# EAGLE design v11 (EAGLE 9.3.0)
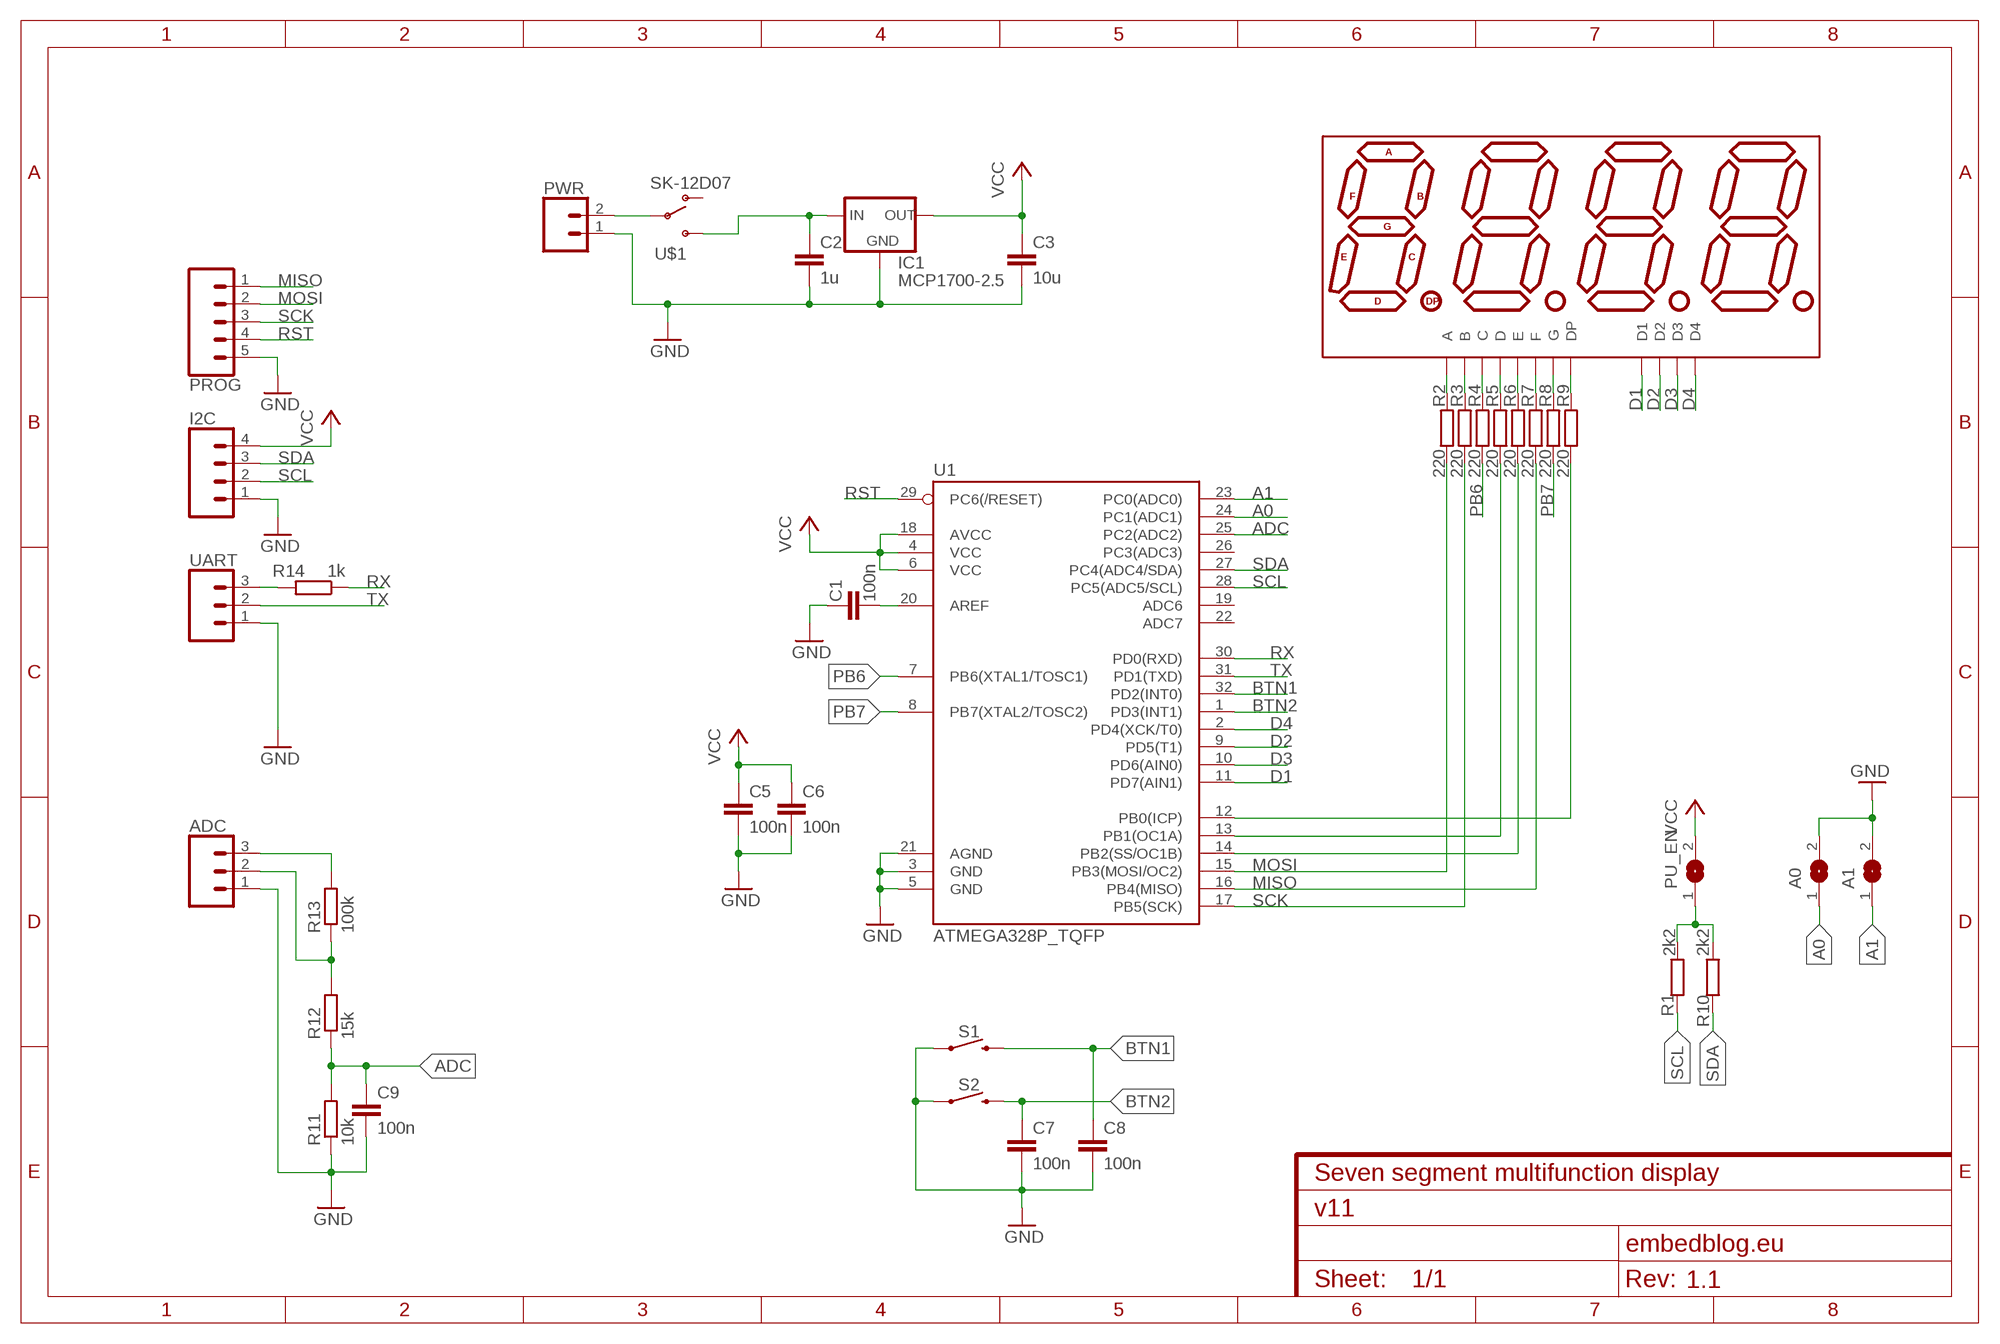
[diagram p0: schematic, sheet 1]
FRAME1 (FRAME-A4L): CNAME: Seven segment multifunction display; CREVISION: 1.1; DESIGNER: embedblog.eu; REV: 1.1

## Parts
A0  SJ  [SJ]
A1  SJ  [SJ]
ADC  455-1750-1-ND  CONN_03  [1X03]
C1  100n  C-EUC1206  [C1206]
C2  1u  C-EUC1206  [C1206]
C3  10u  C-EUC1206  [C1206]
C5  100n  C-EUC1206  [C1206]
C6  100n  C-EUC1206  [C1206]
C7  100n  C-EUC1206  [C1206]
C8  100n  C-EUC1206  [C1206]
C9  100n  C-EUC1206  [C1206]
D1  7-SEG_0.56INCH  [7SEG_0.56INCH]
I2C  CONN_04  [1X04]
IC1  MCP1700-2.5  XC63FPM  [SOT23]
PROG  CONN_05  [1X05]
PU_EN  SJ  [SJ]
PWR  CONN_02  [1X02]
R1  2k2  R-EU_R1206  [R1206]
R2  220  R-EU_R1206  [R1206]
R3  220  R-EU_R1206  [R1206]
R4  220  R-EU_R1206  [R1206]
R5  220  R-EU_R1206  [R1206]
R6  220  R-EU_R1206  [R1206]
R7  220  R-EU_R1206  [R1206]
R8  220  R-EU_R1206  [R1206]
R9  220  R-EU_R1206  [R1206]
R10  2k2  R-EU_R1206  [R1206]
R11  10k  R-EU_R1206  [R1206]
R12  15k  R-EU_R1206  [R1206]
R13  100k  R-EU_R1206  [R1206]
R14  1k  R-EU_R1206  [R1206]
S1  MOMENTARY-SWITCH-SPST-PTH-6.0MM  [TACTILE_SWITCH_PTH_6.0MM]
S2  MOMENTARY-SWITCH-SPST-PTH-6.0MM  [TACTILE_SWITCH_PTH_6.0MM]
U1  ATMEGA328P_TQFP  [TQFP32-08]
U$1  SK-12D07  [SK12SWITCH]
UART  455-1750-1-ND  CONN_03  [1X03]

## Nets
+3V3: C3.1 C5.1 C6.1 I2C.4 IC1.2(OUT) PU_EN.2 U1.4(VCC) U1.6(VCC) U1.18(AVCC) ; supply symbol labelled VCC
A0: A0.1 U1.24(PC1(ADC1))
A1: A1.1 U1.23(PC0(ADC0))
ADC: C9.1 R11.2 R12.1 U1.25(PC2(ADC2))
BTN1: C8.1 S1.3 U1.32(PD2(INT0))
BTN2: C7.1 S2.3 U1.1(PD3(INT1))
D1: D1.D1 U1.11(PD7(AIN1))
D2: D1.D2 U1.9(PD5(T1))
D3: D1.D3 U1.10(PD6(AIN0))
D4: D1.D4 U1.2(PD4(XCK/T0))
GND: A0.2 A1.2 ADC.1 C1.1 C2.2 C3.2 C5.2 C6.2 C7.2 C8.2 C9.2 I2C.1 IC1.1(GND) PROG.5 PWR.1 R11.1 S1.1 S2.1 U1.3(GND) U1.5(GND) U1.21(AGND) UART.1
MISO: PROG.1 R7.1 U1.16(PB4(MISO))
MOSI: PROG.2 R2.1 U1.15(PB3(MOSI/OC2))
N$1: PWR.2 U$1.P2(P)
N$2: C2.1 IC1.3(IN) U$1.IN(S)
N$3: PU_EN.1 R1.2 R10.2
N$5: R14.2 UART.3
N$6: ADC.3 R13.2
N$7: ADC.2 R12.2 R13.1
N$8: D1.A R2.2
N$9: D1.B R3.2
N$10: D1.C R4.2
N$11: D1.D R5.2
N$12: D1.E R6.2
N$13: D1.F R7.2
N$14: D1.G R8.2
N$15: D1.DP R9.2
N$17: C1.2 U1.20(AREF)
N$19: R6.1 U1.14(PB2(SS/OC1B))
N$20: R5.1 U1.13(PB1(OC1A))
N$22: R9.1 U1.12(PB0(ICP))
PB6: R4.1 U1.7(PB6(XTAL1/TOSC1))
PB7: R8.1 U1.8(PB7(XTAL2/TOSC2))
RST: PROG.4 U1.29(PC6(/RESET))
RX: R14.1 U1.30(PD0(RXD))
SCK: PROG.3 R3.1 U1.17(PB5(SCK))
SCL: I2C.2 R1.1 U1.28(PC5(ADC5/SCL))
SDA: I2C.3 R10.1 U1.27(PC4(ADC4/SDA))
TX: U1.31(PD1(TXD)) UART.2
Unconnected: U1.19(ADC6) U1.22(ADC7) U1.26(PC3(ADC3)) U$1.P1(O)

## Library data of the parts
A0 A1 PU_EN = jumper:SJ: SMD solder JUMPER
ADC UART = SparkFun-Connectors:CONN_03: Multi connection point. Often used as Generic Header-pin footprint for 0.1 inch spaced/style header connections On any of the 0.1 inch spaced packages, you can populate with these: Break Away Headers - Straight <https://www.sparkfun.com/products/116> (PRT-00116) Break Away Male Headers - Right Angle <https://www.sparkfun.com/products/553> (PRT-00553) Female Headers <https://www.sparkfun.com/products/115> (PRT-00115) Break Away Headers - Machine Pin <https://www.sparkfun.com/products/117> (PRT-00117) Break Away Female Headers - Swiss Machine Pin <https://www.sparkfun.com/products/743> (PRT-00743) Stackable Header - 3 Pin (Female, 0.1") <https://www.sparkfun.com/products/13875> (PRT-13875) For SCREWTERMINALS and SPRING TERMINALS visit here: Screw Terimnals on SparkFun.com <https://www.sparkfun.com/search/results?term=Screw+Terminals> (5mm/3.5mm/2.54mm spacing) This device is also useful as a general connection point to wire up your design to another part of your project. Our various solder wires solder well into these plated through hole pads. Hook-Up Wire - Assortment (Stranded, 22 AWG) <https://www.sparkfun.com/products/11375> (PRT-11375) Hook-Up Wire - Assortment (Solid Core, 22 AWG) <https://www.sparkfun.com/products/11367> (PRT-11367) View the entire wire category on our website here <https://www.sparkfun.com/categories/141> Special notes: Molex polarized connector foot print use with SKU : PRT-08232 with associated crimp pins and housings.; PROD_ID: XXX-00000
C1-C3 C5-C9 = resistor:C-EU: CAPACITOR, European symbol
D1 = custom:7-SEG_0.56INCH
I2C = SparkFun-Connectors:CONN_04: Multi connection point. Often used as Generic Header-pin footprint for 0.1 inch spaced/style header connections On any of the 0.1 inch spaced packages, you can populate with these: Break Away Headers - Straight <https://www.sparkfun.com/products/116> (PRT-00116) Break Away Male Headers - Right Angle <https://www.sparkfun.com/products/553> (PRT-00553) Female Headers <https://www.sparkfun.com/products/115> (PRT-00115) Break Away Headers - Machine Pin <https://www.sparkfun.com/products/117> (PRT-00117) Break Away Female Headers - Swiss Machine Pin <https://www.sparkfun.com/products/743> (PRT-00743) For SCREWTERMINALS and SPRING TERMINALS visit here: Screw Terimnals on SparkFun.com <https://www.sparkfun.com/search/results?term=Screw+Terminals> (5mm/3.5mm/2.54mm spacing) This device is also useful as a general connection point to wire up your design to another part of your project. Our various solder wires solder well into these plated through hole pads. Hook-Up Wire - Assortment (Stranded, 22 AWG) <https://www.sparkfun.com/products/11375> (PRT-11375) Hook-Up Wire - Assortment (Solid Core, 22 AWG) <https://www.sparkfun.com/products/11367> (PRT-11367) View the entire wire category on our website here <https://www.sparkfun.com/categories/141> Special notes: Molex polarized connector foot print use with SKU : PRT-08231 with associated crimp pins and housings. 1MM SMD Version SKU: PRT-10208; PROD_ID: CONN-09696
IC1 = v-reg:XC63FP: Positiv Voltage Regulators www.torex.co.jp/english/product/pro02/pdf/0201_xc62fp.pdf
PROG = SparkFun-Connectors:CONN_05: Multi connection point. Often used as Generic Header-pin footprint for 0.1 inch spaced/style header connections On any of the 0.1 inch spaced packages, you can populate with these: Break Away Headers - Straight <https://www.sparkfun.com/products/116> (PRT-00116) Break Away Male Headers - Right Angle <https://www.sparkfun.com/products/553> (PRT-00553) Female Headers <https://www.sparkfun.com/products/115> (PRT-00115) Break Away Headers - Machine Pin <https://www.sparkfun.com/products/117> (PRT-00117) Break Away Female Headers - Swiss Machine Pin <https://www.sparkfun.com/products/743> (PRT-00743) For SCREWTERMINALS and SPRING TERMINALS visit here: Screw Terimnals on SparkFun.com <https://www.sparkfun.com/search/results?term=Screw+Terminals> (5mm/3.5mm/2.54mm spacing) This device is also useful as a general connection point to wire up your design to another part of your project. Our various solder wires solder well into these plated through hole pads. Hook-Up Wire - Assortment (Stranded, 22 AWG) <https://www.sparkfun.com/products/11375> (PRT-11375) Hook-Up Wire - Assortment (Solid Core, 22 AWG) <https://www.sparkfun.com/products/11367> (PRT-11367) View the entire wire category on our website here <https://www.sparkfun.com/categories/141> Special notes: Molex polarized connector foot print use with SKU : PRT-08231 with associated crimp pins and housings. 1MM SMD Version SKU: PRT-10208
PWR = SparkFun-Connectors:CONN_02: Multi connection point. Often used as Generic Header-pin footprint for 0.1 inch spaced/style header connections On any of the 0.1 inch spaced packages, you can populate with these: Break Away Headers - Straight <https://www.sparkfun.com/products/116> (PRT-00116) Break Away Male Headers - Right Angle <https://www.sparkfun.com/products/553> (PRT-00553) Female Headers <https://www.sparkfun.com/products/115> (PRT-00115) Break Away Headers - Machine Pin <https://www.sparkfun.com/products/117> (PRT-00117) Break Away Female Headers - Swiss Machine Pin <https://www.sparkfun.com/products/743> (PRT-00743) For SCREWTERMINALS and SPRING TERMINALS visit here: Screw Terimnals on SparkFun.com <https://www.sparkfun.com/search/results?term=Screw+Terminals> (5mm/3.5mm/2.54mm spacing) This device is also useful as a general connection point to wire up your design to another part of your project. Our various solder wires solder well into these plated through hole pads. Hook-Up Wire - Assortment (Stranded, 22 AWG) <https://www.sparkfun.com/products/11375> (PRT-11375) Hook-Up Wire - Assortment (Solid Core, 22 AWG) <https://www.sparkfun.com/products/11367> (PRT-11367) View the entire wire category on our website here <https://www.sparkfun.com/categories/141> Special notes: Molex polarized connector foot print use with: PRT-08233 with associated crimp pins and housings. 2.54_SCREWTERM for use with PRT-10571. 3.5mm Screw Terminal footprints for PRT-08084 5mm Screw Terminal footprints for use with PRT-08432
R1-R14 = resistor:R-EU_: RESISTOR, European symbol
S1 S2 = SparkFun-Switches:MOMENTARY-SWITCH-SPST: Momentary Switch (Pushbutton) - SPST Normally-open (NO) SPST momentary switches (buttons, pushbuttons). Variants PTH-12MM - 12mm square, through-hole Momentary Pushbutton Switch - 12mm Square <https://www.sparkfun.com/products/9190> (COM-09190) PTH-6.0MM, PTH-6.0MM-KIT - 6.0mm square, through-hole Mini Pushbutton Switch <https://www.sparkfun.com/products/97> (COM-00097) KIT package intended for soldering kit's - only one side of pads' copper is exposed. PTH-RIGHT-ANGLE-KIT - Right-angle, through-hole Right Angle Tactile Button <https://www.sparkfun.com/products/10791> - Used on SparkFun BigTime Watch Kit <https://www.sparkfun.com/products/11734> SMD-12MM - 12mm square, surface-mount Tactile Button - SMD (12mm) <https://www.sparkfun.com/products/12993> (COM-12993) Used on SparkFun PicoBoard <https://www.sparkfun.com/products/11888> SMD-4.5MM - 4.5mm Square Trackball Switch Used on SparkFun Blackberry Trackballer Breakout <https://www.sparkfun.com/products/13169> SMD-4.6MMX2.8MM - 4.60mm x 2.80mm, surface mount Used on SparkFun SAMD21 Mini Breakout <https://www.sparkfun.com/products/13664> SMD-5.2MM, SMD-5.2-REDUNDANT - 5.2mm square, surface-mount Mini Pushbutton Switch - SMD <https://www.sparkfun.com/products/8720> (COM-08720) Used on Arduino Pro Mini <https://www.sparkfun.com/products/11114> REDUNDANT package connects both switch circuits together SMD-6.0X3.5MM - 6.0 x 3.5mm, surface mount Momentary Reset Switch SMD <https://www.sparkfun.com/products/8229> (COM-08229) SMD-6.2MM-TALL - 6.2mm square, surface mount Tactile Button - SMD (6mm) <https://www.sparkfun.com/products/12992> Used on SparkFun Digital Sandbox <https://www.sparkfun.com/products/12651> SMD-RIGHT-ANGLE - Right-angle, surface mount Used on SparkFun Block for Intel® Edison - Arduino <https://www.sparkfun.com/products/13036>; PROD_ID: SWCH-08441; SF_SKU: COM-00097
U1 = SparkFun-DigitalIC:ATMEGA328P_TQFP; PROD_ID: IC-09069
U$1 = custom:SK-12D07

## Board
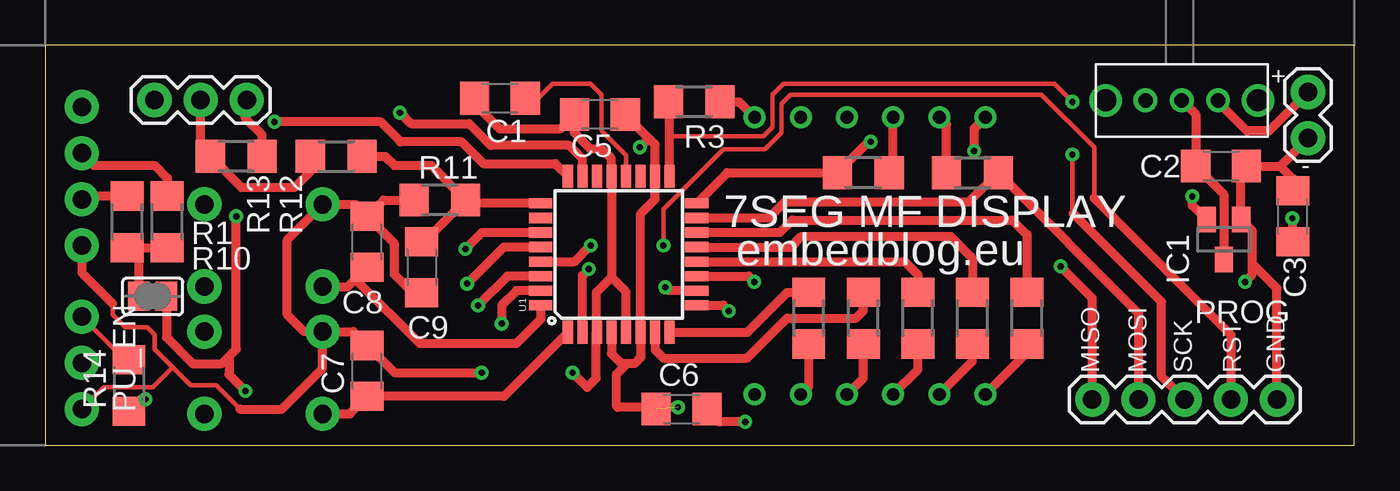
[diagram p1: board, top side]
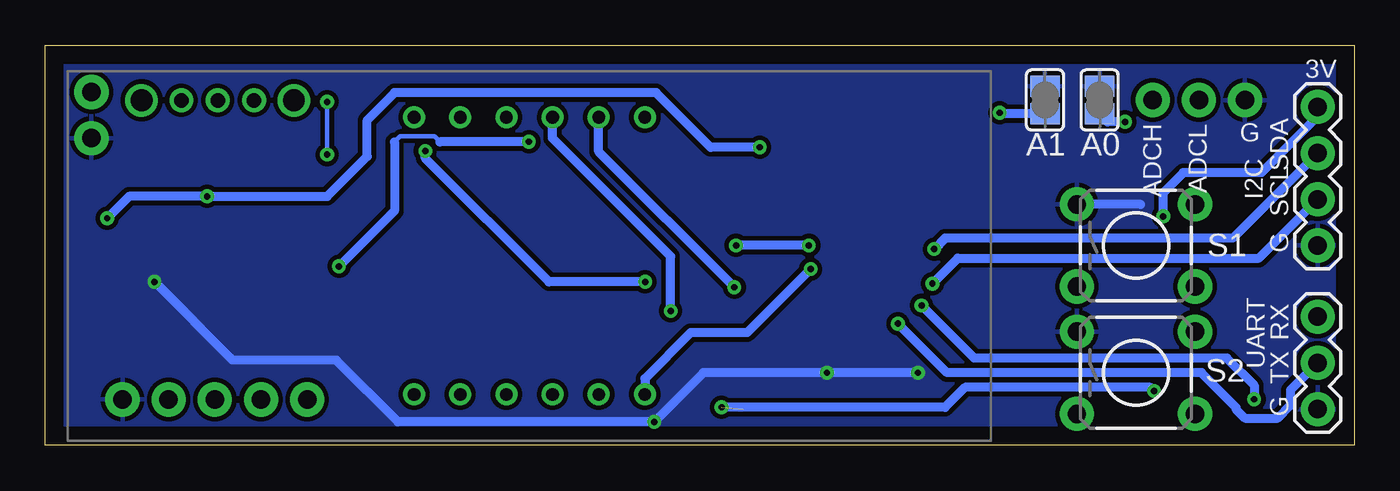
[diagram p2: board, bottom side, seen from below]

Size 72 x 22 mm. Coordinates in mm from the lower left corner, seen from the top.
Outline: 0,0 72,0 72,22 0,22 0,0
Copper layers (1*16): Top 0.035mm / dielectric 1.5mm / Bottom 0.035mm
Design rules "default": minimum track width 6mil, minimum drill 0.35mm, track to track 6mil, track to pad 6mil, pad to pad 6mil, via to via 6mil, smd to smd 6mil, copper to edge 40mil, drill to drill 6mil, minimum pad ring 10mil, minimum via ring 8mil, stop-mask expansion 4mil, vias tented up to drill 0mil, thermal gap 10mil

### Footprints (pad centres in the part's own frame; a part is rotated, then mirrored left to right if it is on the bottom)
SJ = smd 1.168 x 1.6: 1 -0.762,0; 2 0.762,0
1X03 = drill 1.016 pad 1.88: 1 0,0; 2 2.54,0; 3 5.08,0
C1206 = smd 1.6 x 1.8: 1 -1.4,0; 2 1.4,0
7SEG_0.56INCH = drill 0.7: A 2.54,15.24; B 12.7,15.24; C 7.62,0; D 2.54,0; D1 0,15.24; D2 7.62,15.24; D3 10.16,15.24; D4 12.7,0; DP 5.08,0; E 0,0; F 5.08,15.24; G 10.16,0
1X04 = drill 1.016 pad 1.88: 1 0,0; 2 2.54,0; 3 5.08,0; 4 7.62,0
SOT23 = smd 1 x 1.4: 1 -0.95,-1.1; 2 0.95,-1.1; 3 0,1.1
1X05 = drill 1.016 pad 1.88: 1 0,0; 2 2.54,0; 3 5.08,0; 4 7.62,0; 5 10.16,0
1X02 = drill 1.016 pad 1.88: 1 0,0; 2 2.54,0
R1206 = smd 1.6 x 1.803: 1 -1.422,0; 2 1.422,0
TACTILE_SWITCH_PTH_6.0MM = drill 1.016 pad 1.88: 1 -3.251,2.261; 2 3.251,2.261; 3 -3.251,-2.261; 4 3.251,-2.261
TQFP32-08 = smd 1.27 x 0.559: 1 -4.293,2.8; 2 -4.293,2; 3 -4.293,1.2; 4 -4.293,0.4; 5 -4.293,-0.4; 6 -4.293,-1.2; 7 -4.293,-2; 8 -4.293,-2.8; 17 4.293,-2.8; 18 4.293,-2; 19 4.293,-1.2; 20 4.293,-0.4; 21 4.293,0.4; 22 4.293,1.2; 23 4.293,2; 24 4.293,2.8 | smd 0.559 x 1.27: 9 -2.8,-4.293; 10 -2,-4.293; 11 -1.2,-4.293; 12 -0.4,-4.293; 13 0.4,-4.293; 14 1.2,-4.293; 15 2,-4.293; 16 2.8,-4.293; 25 2.8,4.293; 26 2,4.293; 27 1.2,4.293; 28 0.4,4.293; 29 -0.4,4.293; 30 -1.2,4.293; 31 -2,4.293; 32 -2.8,4.293
SK12SWITCH = drill 0.8: IN 0,0; P1 0,2; P2 0,-2 | drill 1.2: PIN1 0,4.191; PIN2 0,-4.191

### Placement (x,y rotation side)
A0  14,19 90 bottom
A1  17,19 90 bottom
ADC  6,19 0 top
C1  25,19.1 0 top
C2  64.68,15.37 0 top
C3  68.63,12.6 90 top
C5  30.5,18.2 180 top
C6  35,2 0 top
C7  17.7,4.1 90 top
C8  17.7,11.2 90 top
C9  20.7,9.8 270 top
D1  51.72,2.81 0 bottom
I2C  2,11 90 bottom
IC1  64.83,11.33 180 top
PROG  57.6,2.53 0 top
PU_EN  5.9,8.2 0 top
PWR  69.47,16.9 90 top
R1  4.5,12.3 270 top
R2  51,15 180 top
R3  35.7,18.9 0 top
R4  45,7 270 top
R5  51,7 270 top
R6  54,7 270 top
R7  45,15 0 top
R8  42,7 270 top
R9  48,7 270 top
R10  6.7,12.3 270 top
R11  21.7,13.5 0 top
R12  16,15.9 180 top
R13  10.5,15.9 0 top
R14  4.6,3.3 90 top
S1  12,11 0 bottom
S2  12,4 0 bottom
U1  31.54,10.51 90 top
U$1  62.52,18.98 90 top
UART  2,2 90 bottom

### Tracks (layer width: path | path; a pad name or v marks a point on that pad's centre or on a via)
+3V3  (via drill 0.35)  (1 unrouted)
  Top 0.508: IC1.2 63.1,13.21 v63.1,13.7 | v68.6,12.5 68.6,11.23 C3.1 | U1.4 31.14,5.06 31.7,4.5 32,4.5 | 32,4.5 32.4,4.5 32.74,4.84 U1.6 32.74,12.74 33.54,13.54 U1.18 33.54,16.56 33.3,16.8 | 32,4.5 31.4,3.9 31.4,2.2 31.5,2.1 v34.8,2.1 | 33.3,16.8 C5.1 | v32.7,16.4 33.1,16.8 33.3,16.8 | PU_EN.2 6.66,5.94 8.1,4.5 9.7,4.5 10.1,4.9 | 10.1,4.9 10.5,5.3 v10.5,12.6 | 10.1,4.9 10.1,3.9 v11,3
  Bottom 0.508: v68.6,12.5 67.4,13.7 v63.1,13.7 56.5,13.7 54.3,15.9 54.3,17.9 52.8,19.4 38.4,19.4 35.4,16.4 v32.7,16.4 | v10.5,12.6 10.5,13.9 9.4,15 5.1,15 2,18.1 I2C.4 | v11,3 11.2,3.2 21.4,3.2 22.5,2.1 v34.8,2.1
A0  (via drill 0.35)
  Top 0.508: U1.24 28.05,15.5 24.1,15.5 22.9,16.7 19.54,16.7 18.44,17.8 v12.6,17.8
  Bottom 0.508: v12.6,17.8 13.56,17.8 A0.1
A1  (via drill 0.35)
  Top 0.508: U1.23 29.54,15.76 28.8,16.5 24.5,16.5 23.3,17.7 20.1,17.7 v19.5,18.3
  Bottom 0.508: A1.1 19.44,18.24 v19.5,18.3
ADC
  Top 0.508: C9.1 20.82,11.2 R11.2 | R12.1 18.7,15.9 19.2,15.4 21.22,15.4 R11.2 | U1.25 23.31,13.31 R11.2
BTN1
  Top 0.508: U1.32 27.25,6.95 25.9,5.6 20.6,5.6 17.05,9.15 | S1.3 16.64,8.74 17.05,9.15 | 17.05,9.15 C8.1
BTN2
  Top 0.508: S2.3 16.74,1.74 C7.1 25.22,2.7 U1.1
D1  (via drill 0.35)
  Top 0.508: U1.11 38.69,9.31 v39,9 | v51.1,16.2 51.1,17.43 D1.D1
  Bottom 0.508: v39,9 44.3,9 51.1,15.8 v51.1,16.2
D2  (via drill 0.35)
  Top 0.508: U1.9 37.29,7.71 v37.6,7.4
  Bottom 0.508: v37.6,7.4 37.6,10.4 44.1,16.9 D1.D2
D3  (via drill 0.35)
  Top 0.508: U1.10 34.29,8.51 v34.1,8.7
  Bottom 0.508: v34.1,8.7 41.56,16.16 D1.D3
D4  (via drill 0.35)
  Top 0.508: U1.2 29.54,9.34 v29.9,9.7
  Bottom 0.508: v29.9,9.7 33.4,6.2 36.5,6.2 39.02,3.68 D1.D4
GND  (via drill 0.35)
  Top 0.254: 3.7,7.8 3.7,7.2 4.4,6.5 5.6,6.5 6,6.1 6,5.3 7,4.3 | 7,4.3 8,3.3 9.4,3.3 10.7,2 | UART.1 3.2,3.2 5.9,3.2 7,4.3
  Top 0.508: 31.14,9.24 U1.21 31.14,15.76 30.6,16.3 30,16.3 29.1,17.2 C5.2 28.3,17.4 25,17.4 23.6,18.8 C1.1 | 31.14,9.24 30.3,8.4 30.3,6.26 | 30.3,6.26 U1.3 | U1.5 31.94,8.44 31.14,9.24 | C2.2 66.2,15.37 | 66.2,15.37 67.94,15.37 | 67.94,15.37 PWR.1 | C3.2 68.63,14.68 67.94,15.37 | 66.2,15.37 65.78,14.95 IC1.1 66.4,11.81 66.4,10 | PROG.5 67.76,8.64 66.4,10 | 30.3,6.26 30.3,3.7 29.8,3.2 v29,4 | v38.5,1.3 37.1,1.3 C6.2 | v66,9 66.4,9.4 66.4,10 | C8.2 17.04,13.26 S1.1 13.3,11.31 13.3,7.2 14.24,6.26 S2.1 | S2.1 16.94,6.26 C7.2 19.2,4 v24,4 | 3.7,7.8 2,9.5 I2C.1 | C8.2 18.6,13.5 R11.1 | C9.2 20.2,8.4 19.2,9.4 19.2,11.1 C8.2 | S2.1 15.25,4.25 13,2 10.7,2
  Bottom 0.508: v66,9 61.7,4.7 56,4.7 52.6,1.3 v38.5,1.3 35.8,4 v29,4 v24,4 | 11.74,13.26 S1.1
  pour Bottom (isolate 0.254): 0,0 72,0 72,22 0,22
MISO  (via drill 0.35)
  Top 0.508: U1.16 37.52,15 R7.1 45.28,16.7 v45.4,16.7 | PROG.1 57.6,8.1 v55.85,9.85
  Bottom 0.254: 50.3,16.7 50.6,17 52.5,17 52.8,16.7
  Bottom 0.508: v45.4,16.7 50.3,16.7 | 52.8,16.7 52.8,12.9 v55.85,9.85
MOSI
  Top 0.508: U1.15 39.81,12.51 40.7,13.4 50.82,13.4 R2.1 60.14,7.28 PROG.2
N$1
  Top 0.508: PWR.2 67.33,17.3 66.1,17.3 64.52,18.88 U$1.P2
N$2
  Top 0.508: U$1.IN 63.28,18.22 C2.1 64.83,13.82 IC1.3
N$3
  Top 0.508: R10.2 R1.2 5.14,10.24 PU_EN.1
N$5
  Top 0.254: R14.2 4.36,4.72 UART.3
N$6
  Top 0.508: 12,15.98 R13.2 11.92,17.08 11,18 11,18.92 ADC.3
N$7
  Top 0.508: ADC.2 8.54,16.44 R13.1 10.78,14.2 13.7,14.2 14.58,15.08 R12.2
N$8
  Top 0.508: R2.2 49.58,17.65 D1.A
N$9
  Top 0.508: R3.2 38.17,18.9 D1.B
N$10
  Top 0.508: D1.C 45,3.71 R4.2
N$11
  Top 0.508: D1.D 51,4.63 R5.2
N$12
  Top 0.508: D1.E 54,5.09 R6.2
N$13
  Top 0.508: R7.2 46.64,15.22 D1.F
N$14
  Top 0.508: D1.G 42,3.25 R8.2
N$15
  Top 0.508: D1.DP 48,4.17 R9.2
N$17
  Top 0.254: C1.2 27.1,19.1 27.9,19.9 30,19.9 30.6,19.3 30.6,17.3 31.94,15.96 U1.20
N$19
  Top 0.508: U1.14 40.41,11.71 41.1,12.4 53.2,12.4 54,11.6 R6.1
N$20
  Top 0.508: U1.13 41.01,10.91 41.6,11.5 49.8,11.5 51,10.3 R5.1
N$22
  Top 0.508: U1.12 47.29,10.11 48,9.4 R9.1
PB6
  Top 0.508: U1.7 33.54,5.26 34,4.8 38.6,4.8 40.8,7 44.6,7 45,7.4 R4.1
PB7
  Top 0.508: U1.8 38.62,6.22 40.82,8.42 R8.1
RST  (via drill 0.35)
  Top 0.254: v34,11 34,13 37.3,16.3 39.6,16.3 40.5,17.2 40.5,18.8 41,19.3 54.8,19.3 57.7,16.4 57.7,13.6
  Top 0.508: U1.29 29.11,10.11 v30,11 | 57.7,13.6 65.22,6.08 PROG.4
  Bottom 0.508: v30,11 v34,11
RX  (via drill 0.35)
  Top 0.508: U1.30 25.41,9.31 v23.8,7.7 | v5.5,2.54 5.26,2.54 R14.1
  Bottom 0.508: v23.8,7.7 20.9,4.8 7,4.8 5.5,3.3 v5.5,2.54
SCK  (via drill 0.35)
  Top 0.254: 34.34,17 39.5,17 40,17.5 40,19.3 40.6,19.9 55.5,19.9 v56.5,18.9 | v56.5,16 56.5,12.8 56.55,12.75
  Top 0.508: U1.17 34.34,17 34.34,18.84 R3.1 | PROG.3 61.4,3.81 61.4,7.9 56.55,12.75
  Bottom 0.254: v56.5,18.9 v56.5,16
SCL  (via drill 0.35)
  Top 0.508: U1.28 25.21,10.91 v23.2,8.9 | I2C.2 2.18,13.72 R1.1
  Bottom 0.508: v23.2,8.9 21.8,10.3 5.24,10.3 I2C.2
SDA  (via drill 0.35)
  Top 0.508: v23.1,10.8 24.01,11.71 U1.27 | R10.1 6.7,14.7 6,15.4 2.68,15.4 I2C.3
  Bottom 0.508: v23.1,10.8 22.5,11.4 6.68,11.4 I2C.3
TX  (via drill 0.35)
  Top 0.508: U1.31 25.91,8.51 25.1,7.7 v25.1,6.7
  Bottom 0.508: v25.1,6.7 22.4,4 8.4,4 6.5,2.1 6.5,2 6,1.5 4.2,1.5 3.5,2.2 3.5,3.04 UART.2

### Text on the board
tNames: + | - | 7SEG MF DISPLAY | embedblog.eu | MISO | MOSI | SCK | RST | GND
bNames: 3V | ADCL | ADCH | G | SDA | SCL | G | RX | TX | G